# Altium schematic sheet SPI_To_Ethernet.SchDoc
size A1
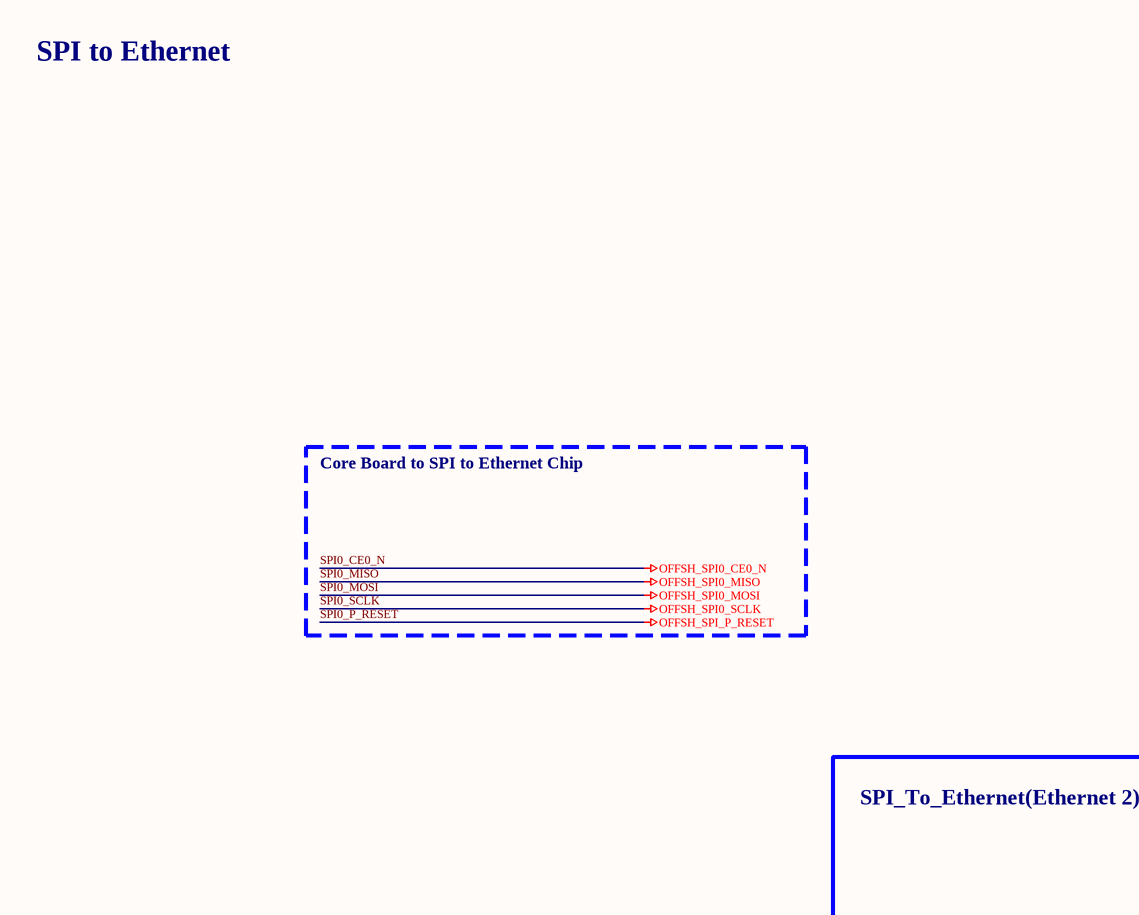
[diagram p0: SPI_To_Ethernet.SchDoc, top left]
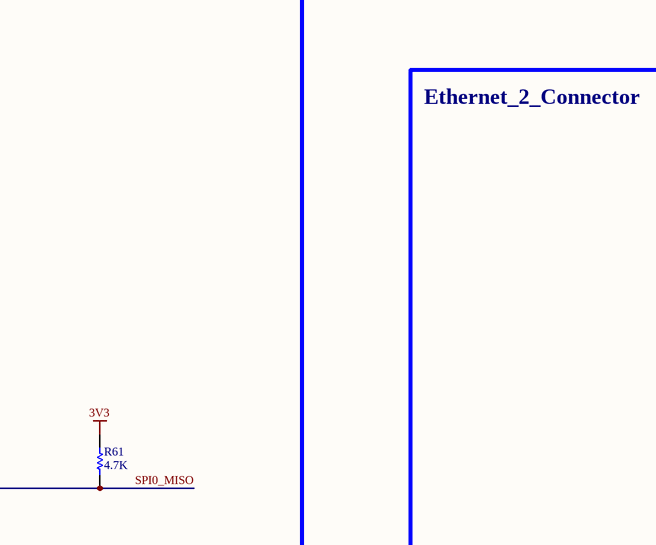
[diagram p1: SPI_To_Ethernet.SchDoc, top right]
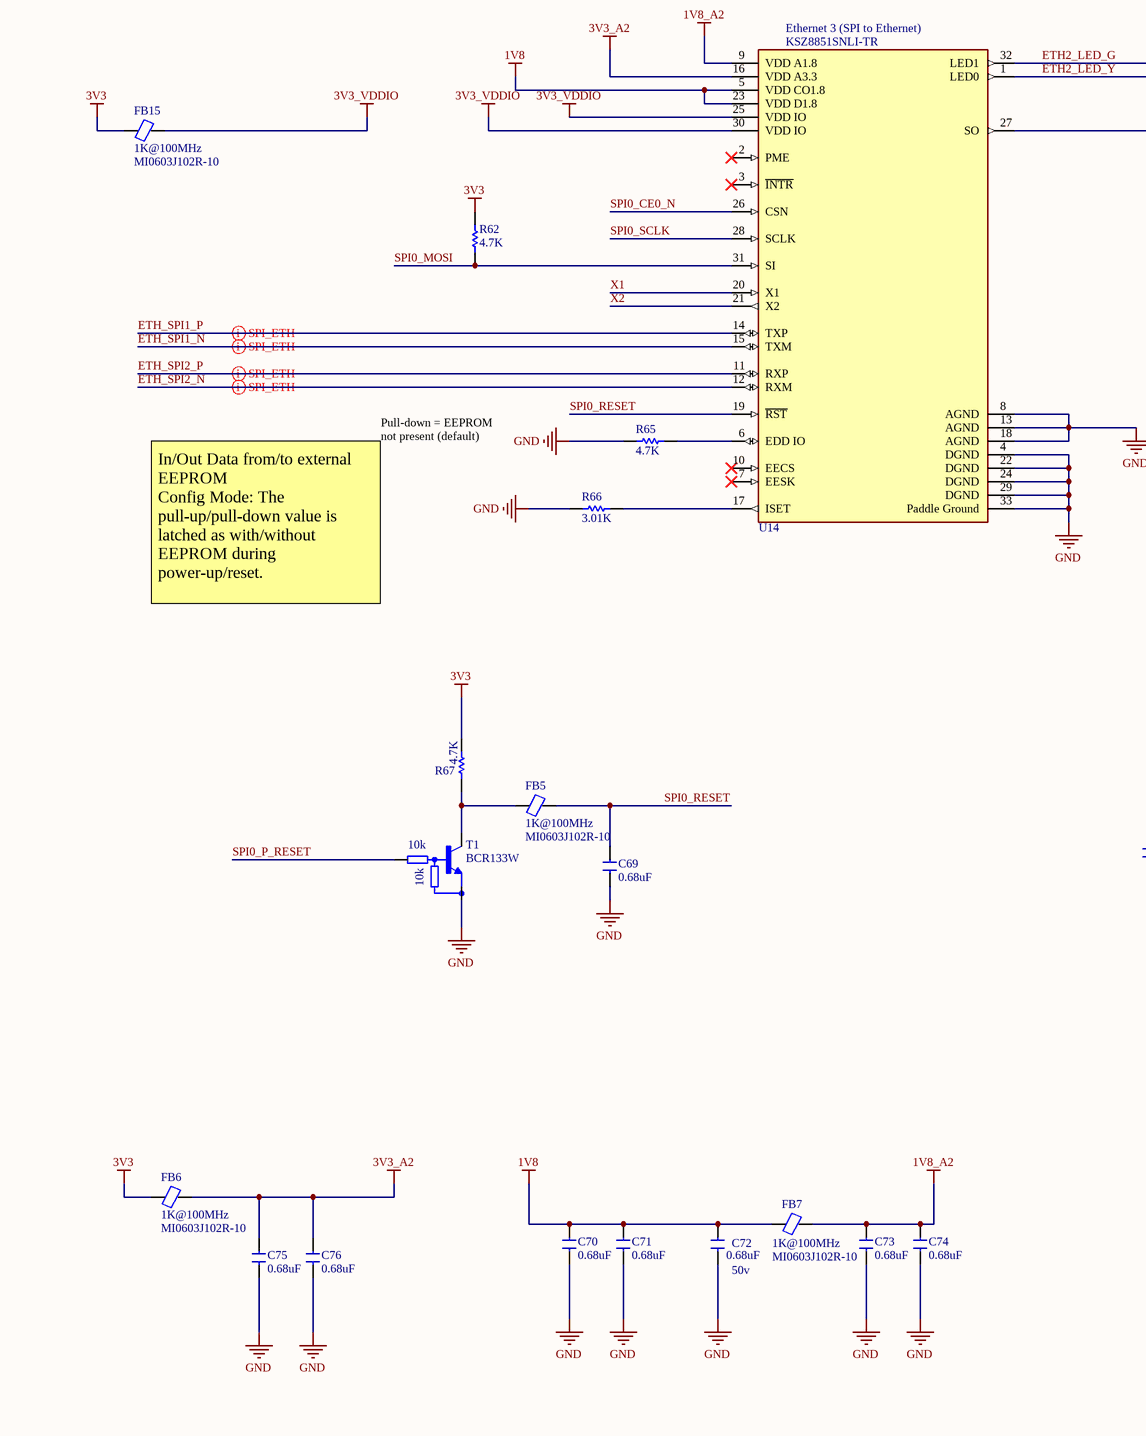
[diagram p2: SPI_To_Ethernet.SchDoc, bottom left]
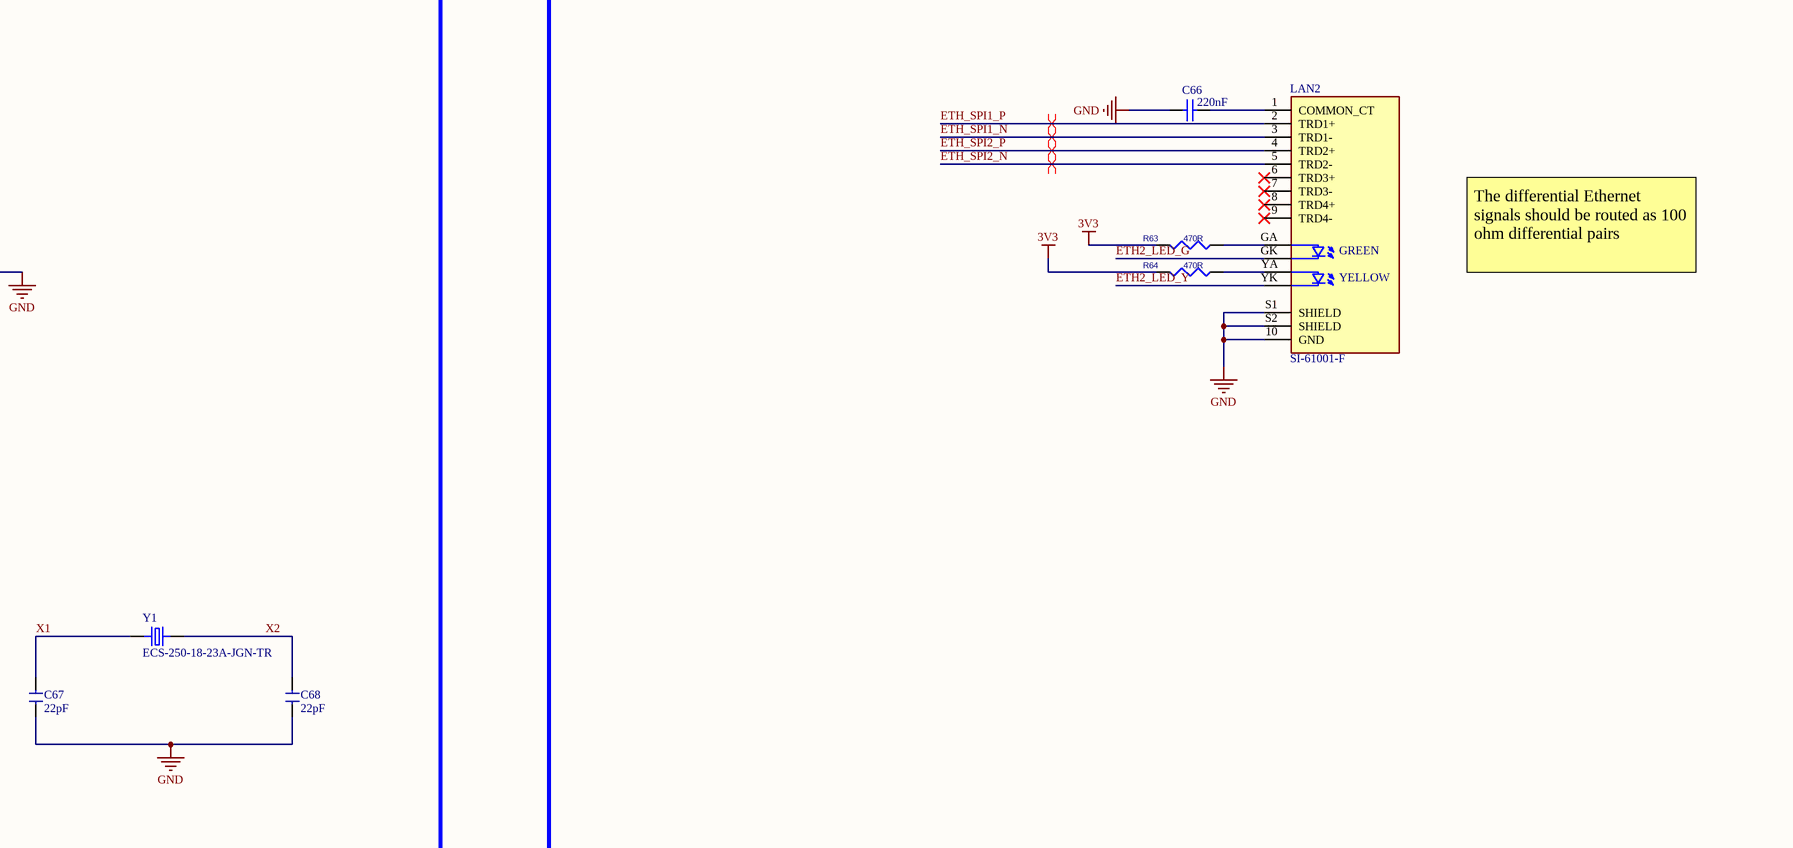
[diagram p3: SPI_To_Ethernet.SchDoc, bottom right]

## Parts
C66  value 220nF  [CAP (0603)]  (hidden comment: Cap)
C67  value 22pF  [0603 Capacitor]  (hidden comment: Capacitor SMD)
C68  value 22pF  [0603 Capacitor]  (hidden comment: Capacitor SMD)
C69  value 0.68uF  [0603 Capacitor]  (hidden comment: Capacitor SMD)
C70  value 0.68uF  [0603 Capacitor]  (hidden comment: Capacitor SMD)
C71  value 0.68uF  [0603 Capacitor]  (hidden comment: Capacitor SMD)
C72  value 0.68uF  Voltage: 50v  [0603 Capacitor]  (hidden comment: Capacitor SMD)
C73  value 0.68uF  [0603 Capacitor]  (hidden comment: Capacitor SMD)
C74  value 0.68uF  [0603 Capacitor]  (hidden comment: Capacitor SMD)
C75  value 0.68uF  [0603 Capacitor]  (hidden comment: Capacitor SMD)
C76  value 0.68uF  [0603 Capacitor]  (hidden comment: Capacitor SMD)
FB5  value 1K@100MHz  Part Number: MI0603J102R-10  [FB0603]  (hidden comment: Ferrite Bead)
FB6  value 1K@100MHz  Part Number: MI0603J102R-10  [FB0603]  (hidden comment: Ferrite Bead)
FB7  value 1K@100MHz  Part Number: MI0603J102R-10  [FB0603]  (hidden comment: Ferrite Bead)
FB15  value 1K@100MHz  Part Number: MI0603J102R-10  [FB0603]  (hidden comment: Ferrite Bead)
LAN2  SI-61001-F  [BEL_SI-61001-F]
R61  value 4.7K  [R0603]  (hidden comment: Res)
R62  value 4.7K  [R0603]  (hidden comment: Res)
R63  470R  [R0603]
R64  470R  [R0603]
R65  value 4.7K  [R0603]  (hidden comment: Res)
R66  value 3.01K  [R0603]  (hidden comment: Res)
R67  value 4.7K  [R0603]  (hidden comment: Res)
T1  BCR133W  [SOT323-BEC]
U14  KSZ8851SNLI-TR  [QFN50P500X500X90-33N]
Y1  ECS-250-18-23A-JGN-TR  [XTAL_ECS-250-18-23A-JGN-TR]

## Blocks framed on the sheet
SPI_To_Ethernet(Ethernet 2): C67-C76 FB5-FB7 FB15 R61 R62 R65-R67 T1 U14 Y1
Ethernet_2_Connector: C66 LAN2 R63 R64

## Nets
1V8: C70.1 C71.1 C72.2 FB7.1 U14.5(VDD_CO1.8) U14.23(VDD_D1.8)
1V8_A2: C73.1 C74.1 FB7.2 U14.9(VDD_A1.8)
3V3: FB6.1 FB15.1 R61.2 R62.2 R63.1 R64.1 R67.2
3V3_A2: C75.1 C76.1 FB6.2 U14.16(VDD_A3.3)
3V3_VDDIO: FB15.2 U14.25(VDD_IO) U14.30(VDD_IO)
GND: C66.1 C67.2 C68.2 C69.2 C70.2 C71.2 C72.1 C73.2 C74.2 C75.2 C76.2 LAN2.10(GND) LAN2.S1(SHIELD) LAN2.S2(SHIELD) R65.1 R66.1 T1.E U14.4(DGND) U14.8(AGND) U14.13(AGND) U14.18(AGND) U14.22(DGND) U14.24(DGND) U14.29(DGND) U14.33(Paddle_Ground)
SPI0_CE0_N: U14.26(CSN)  [also labelled OFFSH_SPI0_CE0_N]
SPI0_MISO: R61.1 U14.27(SO)  [also labelled OFFSH_SPI0_MISO]
SPI0_MOSI: R62.1 U14.31(SI)  [also labelled OFFSH_SPI0_MOSI]
SPI0_P_RESET: T1.B  [also labelled OFFSH_SPI_P_RESET]
SPI0_SCLK: U14.28(SCLK)  [also labelled OFFSH_SPI0_SCLK]
ETH2_LED_G: LAN2.GK U14.32(LED1)
ETH2_LED_Y: LAN2.YK U14.1(LED0)
ETH_SPI1_N: LAN2.3(TRD1-) U14.15(TXM)
ETH_SPI1_P: LAN2.2(TRD1+) U14.14(TXP)
ETH_SPI2_N: LAN2.5(TRD2-) U14.12(RXM)
ETH_SPI2_P: LAN2.4(TRD2+) U14.11(RXP)
SPI0_RESET: C69.1 FB5.2 U14.19(~{RST})
X1: C67.1 U14.20(X1) Y1.1(IN/OUT)
X2: C68.1 U14.21(X2) Y1.2(OUT/IN)
NetC66_2: C66.2 LAN2.1(COMMON_CT)
NetFB5_1: FB5.1 R67.1 T1.C
NetLAN2_GA: LAN2.GA R63.2
NetLAN2_YA: LAN2.YA R64.2
NetR65_2: R65.2 U14.6(EDD_IO)
NetR66_2: R66.2 U14.17(ISET)

Not connected (* = marked no-connect by the designer): LAN2 6(TRD3+)* 7(TRD3-)* 8(TRD4+)* 9(TRD4-)*; U14 2(PME)* 3(~{INTR})* 7(EESK)* 10(EECS)*

## Layout directives
differential pair; differential pair class SPI_ETH: ETH_SPI1_N, ETH_SPI1_P, ETH_SPI2_N, ETH_SPI2_P
differential pair: ETH_SPI1_N, ETH_SPI1_P, ETH_SPI2_N, ETH_SPI2_P

## Notes on the sheet
- SPI to Ethernet
- Core Board to SPI to Ethernet Chip
- (near U14) Ethernet 3 (SPI to Ethernet)
- Pull-down = EEPROM not present (default)
- The differential Ethernet signals should be routed as 100 ohm differential pairs
- In/Out Data from/to external EEPROM
  Config Mode: The pull-up/pull-down value is latched as with/without
  EEPROM during power-up/reset.
- (in symbol BCR133W) 10k
- (in symbol SI-61001-F) GREEN; YELLOW

## Library data of the parts
C66 = Cap: SMD capacitor; Part Number: SMD CAP (0603)
C67-C71 C73-C76 = Capacitor SMD: Voltage: 50v
FB5-FB7 FB15 = Ferrite Bead: Ferrite Bead SMD; Link: https://www.digikey.com/product-detail/en/laird-signal-integrity-products/MI0805J102R-10/240-2551-1-ND/1015989
LAN2 = SI-61001-F: Conn RJ-45 RCP 8 POS 1.27mm Solder RA Thru-Hole 14 Terminal 1 Port; MF: Bel Magnetic Solutions; Value: *; MP: SI-61001-F; Price: None; Availability: Unavailable; Package: None; SnapEDA_Link: https://www.snapeda.com/parts/SI-61001-F/Bel%20Magnetic%20Solutions/view-part/4791152/?ref=snap
R61 R62 R65-R67 = Res: Resistor; Published: 8-Jun-2000; LatestRevisionDate: 17-Jul-2002; LatestRevisionNote: Re-released for DXP Platform.; PackageReference: AXIAL-0.3; Publisher: Altium Limited
R63 R64 = RES: Value: 470
T1 = BCR133W: <b>NPN Silicon Digital Transistor</b>  50V 0,1A 0,25W; Package: None; Price: None; Value: *; MP: BCR133W; Availability: Unavailable
Y1 = ECS-250-18-23A-JGN-TR: Crystal 2-SMD, No Lead; Package: None; Price: None; Value: *; MP: ECS-250-18-23A-JGN-TR; Availability: Unavailable